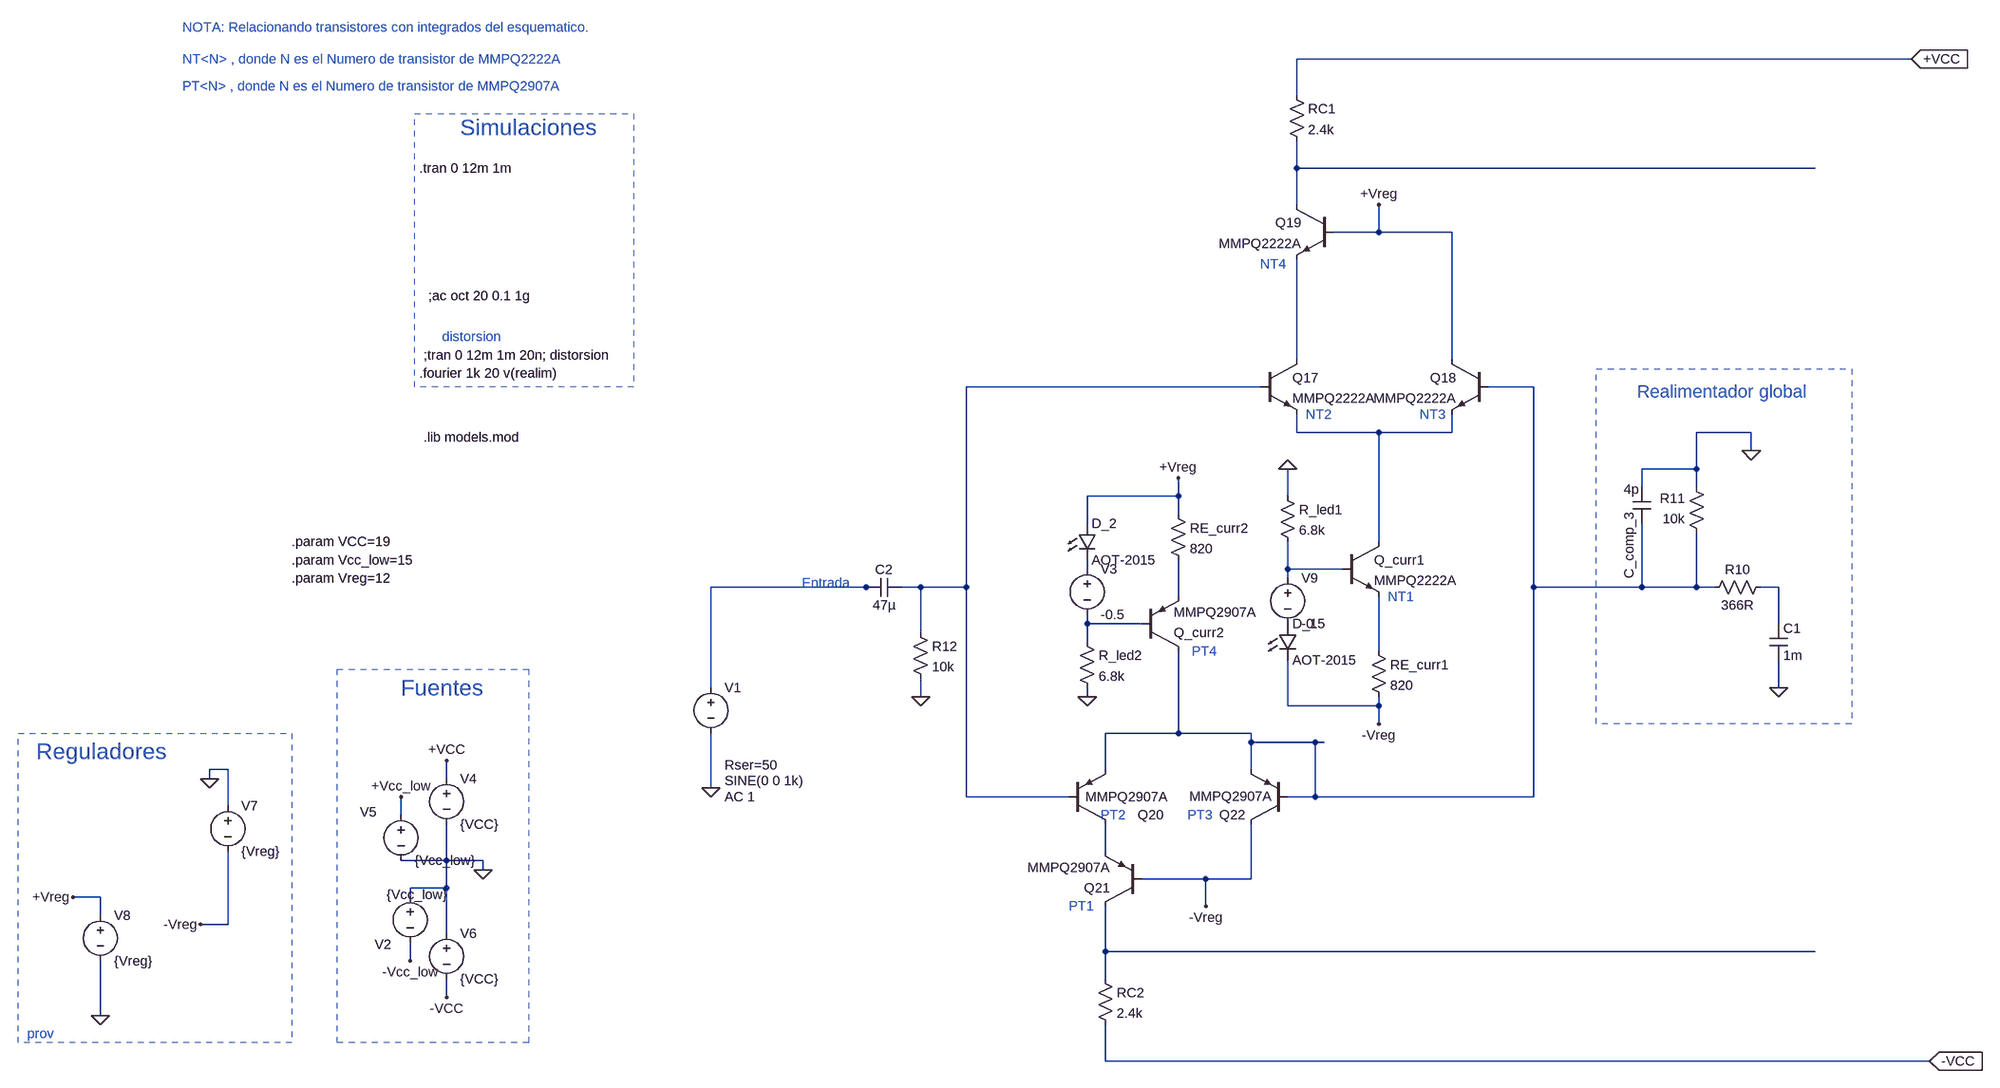
[diagram p0: schematic primera-etapa.asc]
primera-etapa.asc, the LTspice schematic file:
Version 4
SHEET 1 6132 1092
WIRE 2688 -752 464 -752
WIRE 464 -688 464 -752
WIRE 464 -560 464 -608
WIRE 1392 -560 464 -560
WIRE 464 -496 464 -560
WIRE 608 -448 608 -496
WIRE 608 -448 528 -448
WIRE 736 -448 608 -448
WIRE 464 -224 464 -400
WIRE 736 -224 736 -448
WIRE 400 -176 -128 -176
WIRE 880 -176 800 -176
WIRE 464 -96 464 -128
WIRE 608 -96 464 -96
WIRE 736 -96 736 -128
WIRE 736 -96 608 -96
WIRE 1280 -96 1184 -96
WIRE 1280 -64 1280 -96
WIRE 1184 -32 1184 -96
WIRE 1184 -32 1088 -32
WIRE 1088 0 1088 -32
WIRE 1184 0 1184 -32
WIRE 256 16 256 -16
WIRE 256 16 96 16
WIRE 448 16 448 -32
WIRE 256 48 256 16
WIRE 96 64 96 16
WIRE 608 96 608 -96
WIRE 96 144 96 128
WIRE 448 144 448 96
WIRE 544 144 448 144
WIRE 448 160 448 144
WIRE -304 176 -576 176
WIRE -288 176 -304 176
WIRE -208 176 -240 176
WIRE -128 176 -128 -176
WIRE -128 176 -208 176
WIRE 880 176 880 -176
WIRE 1088 176 1088 64
WIRE 1088 176 880 176
WIRE 1184 176 1184 80
WIRE 1184 176 1088 176
WIRE 1216 176 1184 176
WIRE 1328 176 1296 176
WIRE 256 192 256 128
WIRE 96 240 96 224
WIRE 192 240 96 240
WIRE 1328 240 1328 176
WIRE -208 256 -208 176
WIRE 96 272 96 240
WIRE 608 288 608 192
WIRE -576 352 -576 176
WIRE 1328 352 1328 304
WIRE -208 368 -208 336
WIRE 96 368 96 352
WIRE 448 384 448 304
WIRE 608 384 608 368
WIRE 608 384 448 384
WIRE 608 416 608 384
WIRE 256 432 256 288
WIRE 256 432 128 432
WIRE 384 432 256 432
WIRE 384 448 384 432
WIRE 496 448 384 448
WIRE 512 448 496 448
WIRE -1504 496 -1536 496
WIRE 128 496 128 432
WIRE 384 496 384 448
WIRE -1536 512 -1536 496
WIRE -1120 512 -1120 480
WIRE -576 528 -576 432
WIRE -128 544 -128 176
WIRE 64 544 -128 544
WIRE 496 544 496 448
WIRE 496 544 448 544
WIRE 880 544 880 176
WIRE 880 544 496 544
WIRE -1504 560 -1504 496
WIRE -1200 576 -1200 544
WIRE 128 640 128 592
WIRE -1120 656 -1120 592
WIRE -1120 656 -1200 656
WIRE -1056 656 -1120 656
WIRE -1056 672 -1056 656
WIRE 304 688 192 688
WIRE 384 688 384 592
WIRE 384 688 304 688
WIRE -1120 704 -1120 656
WIRE -1120 704 -1184 704
WIRE -1728 720 -1776 720
WIRE -1184 720 -1184 704
WIRE 304 736 304 688
WIRE -1728 752 -1728 720
WIRE -1504 768 -1504 640
WIRE -1504 768 -1552 768
WIRE -1120 784 -1120 704
WIRE 128 816 128 736
WIRE 1392 816 128 816
WIRE -1184 832 -1184 800
WIRE 128 864 128 816
WIRE -1120 896 -1120 864
WIRE -1728 928 -1728 832
WIRE 128 1008 128 944
WIRE 2720 1008 128 1008
FLAG 2720 1008 -VCC
IOPIN 2720 1008 In
FLAG 2688 -752 +VCC
IOPIN 2688 -752 In
FLAG -208 368 0
FLAG 608 -496 +Vreg
FLAG 608 416 -Vreg
FLAG 256 -16 +Vreg
FLAG 304 736 -Vreg
FLAG 96 368 0
FLAG 448 -32 0
FLAG 1328 352 0
FLAG -576 528 0
FLAG 1280 -64 0
FLAG -1056 672 0
FLAG -1120 480 +VCC
FLAG -1200 544 +Vcc_low
FLAG -1184 832 -Vcc_low
FLAG -1120 896 -VCC
FLAG -1776 720 +Vreg
FLAG -1552 768 -Vreg
FLAG -1728 928 0
FLAG -1536 512 0
SYMBOL res 1200 192 R270
WINDOW 0 32 56 VTop 2
WINDOW 3 0 56 VBottom 2
SYMATTR InstName R10
SYMATTR Value 366R
SYMBOL res 1200 96 R180
WINDOW 0 36 76 Left 2
WINDOW 3 36 40 Left 2
SYMATTR InstName R11
SYMATTR Value 10k
SYMBOL res -224 240 R0
SYMATTR InstName R12
SYMATTR Value 10k
SYMBOL cap 1312 240 R0
SYMATTR InstName C1
SYMATTR Value 1m
SYMBOL cap -240 160 R90
WINDOW 0 0 32 VBottom 2
WINDOW 3 32 32 VTop 2
SYMATTR InstName C2
SYMATTR Value 47µ
SYMBOL cap 1104 64 R180
WINDOW 0 38 20 VLeft 2
WINDOW 3 21 60 Left 2
SYMATTR InstName C_comp_3
SYMATTR Value 4p
SYMBOL npn 544 96 R0
SYMATTR InstName Q_curr1
SYMATTR Value MMPQ2222A
SYMBOL npn 400 -224 R0
SYMATTR InstName Q17
SYMATTR Value MMPQ2222A
SYMBOL npn 800 -224 M0
SYMATTR InstName Q18
SYMATTR Value MMPQ2222A
SYMBOL res 432 0 R0
SYMATTR InstName R_led1
SYMATTR Value 6.8k
SYMBOL res 592 272 R0
SYMATTR InstName RE_curr1
SYMATTR Value 820
SYMBOL LED 432 240 R0
SYMATTR InstName D_1
SYMATTR Value AOT-2015
SYMBOL res 448 -704 R0
SYMATTR InstName RC1
SYMATTR Value 2.4k
SYMBOL npn 528 -496 M0
SYMATTR InstName Q19
SYMATTR Value MMPQ2222A
SYMBOL res 240 32 R0
SYMATTR InstName RE_curr2
SYMATTR Value 820
SYMBOL pnp 192 288 M180
SYMATTR InstName Q_curr2
SYMATTR Value MMPQ2907A
SYMBOL pnp 64 592 M180
WINDOW 0 121 16 Left 2
WINDOW 3 29 48 Left 2
SYMATTR InstName Q20
SYMATTR Value MMPQ2907A
SYMBOL pnp 192 736 R180
SYMATTR InstName Q21
SYMATTR Value MMPQ2907A
SYMBOL res 112 848 R0
SYMATTR InstName RC2
SYMATTR Value 2.4k
SYMBOL pnp 448 592 R180
WINDOW 0 74 16 Left 2
WINDOW 3 28 49 Left 2
SYMATTR InstName Q22
SYMATTR Value MMPQ2907A
SYMBOL LED 80 64 R0
SYMATTR InstName D_2
SYMATTR Value AOT-2015
SYMBOL res 80 256 R0
SYMATTR InstName R_led2
SYMATTR Value 6.8k
SYMBOL voltage -576 336 R0
WINDOW 3 24 180 Left 2
WINDOW 123 24 208 Left 2
WINDOW 39 24 152 Left 2
SYMATTR Value SINE(0 0 1k)
SYMATTR Value2 AC 1
SYMATTR SpiceLine Rser=50
SYMATTR InstName V1
SYMBOL voltage -1184 704 R0
WINDOW 0 -62 99 Left 2
WINDOW 3 -41 12 Left 2
WINDOW 123 0 0 Left 2
WINDOW 39 0 0 Left 2
SYMATTR InstName V2
SYMATTR Value {Vcc_low}
SYMBOL voltage -1120 496 R0
WINDOW 123 0 0 Left 2
WINDOW 39 0 0 Left 2
SYMATTR InstName V4
SYMATTR Value {VCC}
SYMBOL voltage -1200 560 R0
WINDOW 0 -72 11 Left 2
WINDOW 123 0 0 Left 2
WINDOW 39 0 0 Left 2
SYMATTR InstName V5
SYMATTR Value {Vcc_low}
SYMBOL voltage -1120 768 R0
WINDOW 123 0 0 Left 2
WINDOW 39 0 0 Left 2
SYMATTR InstName V6
SYMATTR Value {VCC}
SYMBOL voltage -1504 544 R0
WINDOW 123 0 0 Left 2
WINDOW 39 0 0 Left 2
SYMATTR InstName V7
SYMATTR Value {Vreg}
SYMBOL voltage -1728 736 R0
WINDOW 123 0 0 Left 2
WINDOW 39 0 0 Left 2
SYMATTR InstName V8
SYMATTR Value {Vreg}
SYMBOL voltage 96 128 R0
WINDOW 123 0 0 Left 2
WINDOW 39 0 0 Left 2
SYMATTR InstName V3
SYMATTR Value -0.5
SYMBOL voltage 448 144 R0
WINDOW 123 0 0 Left 2
WINDOW 39 0 0 Left 2
SYMATTR InstName V9
SYMATTR Value -0.5
TEXT -1168 -560 Left 2 !.tran 0 12m 1m
TEXT -1168 -200 Left 2 !.fourier 1k 20 v(realim)
TEXT -1096 -632 Left 4 ;Simulaciones
TEXT -1160 -232 Left 2 !;tran 0 12m 1m 20n; distorsion
TEXT -1128 -264 Left 2 ;distorsion
TEXT -1152 -336 Left 2 !;ac oct 20 0.1 1g
TEXT -1160 -88 Left 2 !.lib models.mod
TEXT 1080 -168 Left 3 ;Realimentador global
TEXT 480 -128 Left 2 ;NT2
TEXT 680 -128 Left 2 ;NT3
TEXT 624 192 Left 2 ;NT1
TEXT 400 -392 Left 2 ;NT4
TEXT 120 576 Left 2 ;PT2
TEXT -1584 -752 Left 2 ;NT<N> , donde N es el Numero de transistor de MMPQ2222A
TEXT -1584 -704 Left 2 ;PT<N> , donde N es el Numero de transistor de MMPQ2907A
TEXT -1584 -808 Left 2 ;NOTA: Relacionando transistores con integrados del esquematico.
TEXT 64 736 Left 2 ;PT1
TEXT 272 576 Left 2 ;PT3
TEXT 280 288 Left 2 ;PT4
TEXT -416 168 Left 2 ;Entrada
TEXT -1200 352 Left 4 ;Fuentes
TEXT -1840 464 Left 4 ;Reguladores
TEXT -1856 960 Left 2 ;prov
TEXT -1392 96 Left 2 !.param VCC=19
TEXT -1392 128 Left 2 !.param Vcc_low=15
TEXT -1392 160 Left 2 !.param Vreg=12
RECTANGLE Normal -792 -176 -1176 -656 2
RECTANGLE Normal 1456 416 1008 -208 2
RECTANGLE Normal -976 976 -1312 320 2
RECTANGLE Normal -1392 976 -1872 432 2

The netlist it stands for:
* primera-etapa.asc
R10 N004 N009 366R
R11 N004 0 10k
R12 N003 0 10k
C1 N009 0 1m
C2 N003 N008 47µ
C_comp_3 N004 0 4p
Q_curr1 N005 N007 N012 0 MMPQ2222A
Q17 N002 N003 N005 0 MMPQ2222A
Q18 +Vreg N004 N005 0 MMPQ2222A
R_led1 0 N007 6.8k
RE_curr1 N012 -Vreg 820
D_1 P001 -Vreg AOT-2015
RC1 +VCC N001 2.4k
Q19 N001 +Vreg N002 0 MMPQ2222A
RE_curr2 +Vreg N010 820
Q_curr2 N004 N011 N010 0 MMPQ2907A
Q20 N013 N003 N004 0 MMPQ2907A
Q21 N014 -Vreg N013 0 MMPQ2907A
RC2 N014 -VCC 2.4k
Q22 -Vreg N004 N004 0 MMPQ2907A
D_2 +Vreg N006 AOT-2015
R_led2 N011 0 6.8k
V1 N008 0 SINE(0 0 1k) AC 1 Rser=50
V2 0 -Vcc_low {Vcc_low}
V4 +VCC 0 {VCC}
V5 +Vcc_low 0 {Vcc_low}
V6 0 -VCC {VCC}
V7 0 -Vreg {Vreg}
V8 +Vreg 0 {Vreg}
V3 N006 N011 -0.5
V9 N007 P001 -0.5
.model D D
.lib standard.dio
.model NPN NPN
.model PNP PNP
.lib standard.bjt
.tran 0 12m 1m
.fourier 1k 20 v(realim)
* Simulaciones
;tran 0 12m 1m 20n; distorsion
* distorsion
;ac oct 20 0.1 1g
.lib models.mod
* Realimentador global
* NT2
* NT3
* NT1
* NT4
* PT2
* NT<N> , donde N es el Numero de transistor de MMPQ2222A
* PT<N> , donde N es el Numero de transistor de MMPQ2907A
* NOTA: Relacionando transistores con integrados del esquematico.
* PT1
* PT3
* PT4
* Entrada
* Fuentes
* Reguladores
* prov
.param VCC=19
.param Vcc_low=15
.param Vreg=12
.backanno
.end